# EAGLE schematic Pro Trinket-Micro Keyboard Jr v1 (EAGLE 7.4.0)
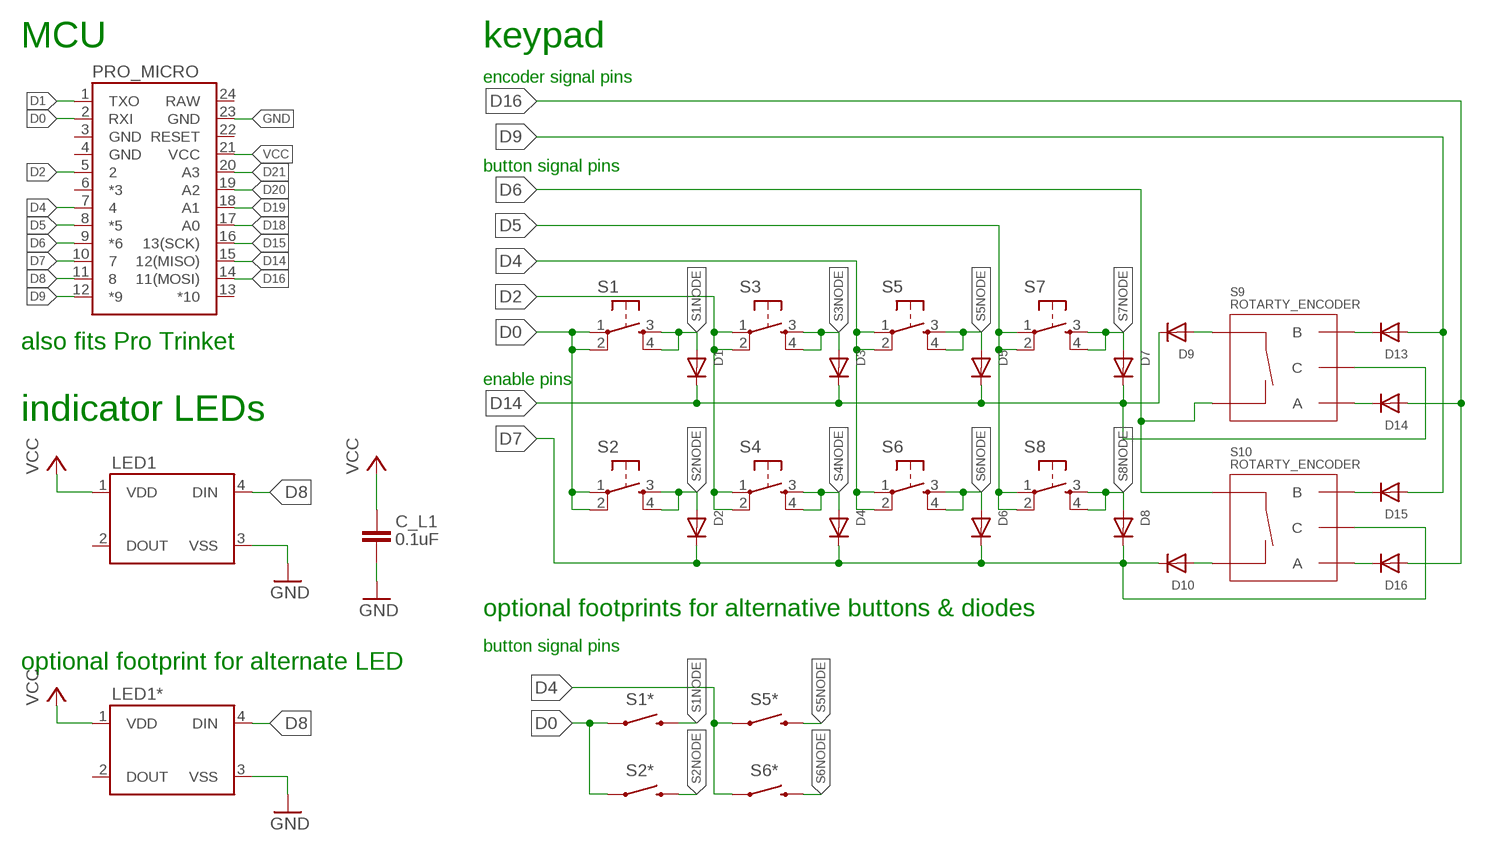
[diagram p0: schematic, sheet 1]

## Parts
C_L1  0.1uF  22PF-50V-5%(0603)  [0603-CAP]
D1  DIODESOD-123  [SOD-123]
D2  DIODESOD-123  [SOD-123]
D3  DIODESOD-123  [SOD-123]
D4  DIODESOD-123  [SOD-123]
D5  DIODESOD-123  [SOD-123]
D6  DIODESOD-123  [SOD-123]
D7  DIODESOD-123  [SOD-123]
D8  DIODESOD-123  [SOD-123]
D9  DIODESOD-123  [SOD-123]
D10  DIODESOD-123  [SOD-123]
D13  DIODESOD-123  [SOD-123]
D14  DIODESOD-123  [SOD-123]
D15  DIODESOD-123  [SOD-123]
D16  DIODESOD-123  [SOD-123]
LED1  WS2812B  [WS2812B]
LED1*  WS2812B  [WS2812B]
PRO_MICRO  ARDUINO_PRO_MICRO  [ARDUINO_PRO_MICRO]
S1  TACTILE-SWITCH-PTH  [TAC-SWITCH-PTH]
S1*  SWITCH-MOMENTARY-212MM  [TACTILE-PTH-12MM]
S2  TACTILE-SWITCH-PTH  [TAC-SWITCH-PTH]
S2*  SWITCH-MOMENTARY-212MM  [TACTILE-PTH-12MM]
S3  TACTILE-SWITCH-PTH  [TAC-SWITCH-PTH]
S4  TACTILE-SWITCH-PTH  [TAC-SWITCH-PTH]
S5  TACTILE-SWITCH-PTH  [TAC-SWITCH-PTH]
S5*  SWITCH-MOMENTARY-212MM  [TACTILE-PTH-12MM]
S6  TACTILE-SWITCH-PTH  [TAC-SWITCH-PTH]
S6*  SWITCH-MOMENTARY-212MM  [TACTILE-PTH-12MM]
S7  TACTILE-SWITCH-PTH  [TAC-SWITCH-PTH]
S8  TACTILE-SWITCH-PTH  [TAC-SWITCH-PTH]
S9  ROTARTY_ENCODER  [ROTARY_ENC_PLAIN]
S10  ROTARTY_ENCODER  [ROTARY_ENC_PLAIN]

## Nets
D0: PRO_MICRO.2(RXI) S1*.1 S1*.2 S1.1 S1.2 S2*.1 S2*.2 S2.1 S2.2
D1: PRO_MICRO.1(TXO)
D2: PRO_MICRO.5 S3.1 S3.2 S4.1 S4.2
D4: PRO_MICRO.7 S5*.1 S5*.2 S5.1 S5.2 S6*.1 S6*.2 S6.1 S6.2
D5: PRO_MICRO.8(*5) S7.1 S7.2 S8.1 S8.2
D6: PRO_MICRO.9(*6) S9.SW- S10.SW+
D7: D2.C D4.C D6.C D8.C D10.C PRO_MICRO.10 S10.C
D8: LED1*.4(DIN) LED1.4(DIN) PRO_MICRO.11
D9: D13.A D15.A PRO_MICRO.12(*9)
D14: D1.C D3.C D5.C D7.C D9.C PRO_MICRO.15(12(MISO)) S9.C
D15: PRO_MICRO.16(13(SCK))
D16: D14.A D16.A PRO_MICRO.14(11(MOSI))
D18: PRO_MICRO.17(A0)
D19: PRO_MICRO.18(A1)
D20: PRO_MICRO.19(A2)
D21: PRO_MICRO.20(A3)
GND: C_L1.1 LED1*.3(VSS) LED1.3(VSS) PRO_MICRO.23(GND)
N$1: D9.A S9.SW+
N$34: D10.A S10.SW-
N$41: D16.C S10.A
N$42: D15.C S10.B
N$43: D14.C S9.A
N$44: D13.C S9.B
S1NODE: D1.A S1*.3 S1*.4 S1.3 S1.4
S2NODE: D2.A S2*.3 S2*.4 S2.3 S2.4
S3NODE: D3.A S3.3 S3.4
S4NODE: D4.A S4.3 S4.4
S5NODE: D5.A S5*.3 S5*.4 S5.3 S5.4
S6NODE: D6.A S6*.3 S6*.4 S6.3 S6.4
S7NODE: D7.A S7.3 S7.4
S8NODE: D8.A S8.3 S8.4
VCC: C_L1.2 LED1*.1(VDD) LED1.1(VDD) PRO_MICRO.21(VCC)
Unconnected: LED1*.2(DOUT) LED1.2(DOUT) PRO_MICRO.3(GND) PRO_MICRO.4(GND) PRO_MICRO.6(*3) PRO_MICRO.13(*10) PRO_MICRO.22(RESET) PRO_MICRO.24(RAW)

## Notes on the sheet
- MCU | keypad
- encoder signal pins
- button signal pins
- also fits Pro Trinket
- enable pins
- indicator LEDs
- optional footprints for alternative buttons & diodes
- button signal pins
- optional footprint for alternate LED

## Library data of the parts
C_L1 = SparkFun-Capacitors:22PF-50V-5%(0603): CAP-07876; PROD_ID: CAP-07876; VALUE: 22pF
D1-D10 D13-D16 = adafruit:DIODE: Diode SMADIODE - SMA Surface Mount Package 20V 1A Schottky Diode Digikey: 641-1014-6-ND DO-1N4148 - Through Hole Small Current Diode SOD-123 20V 1 A (.5mV Vf) Schottky Diode - Digikey: MBRX120TPMSCT-ND SOD-323 10V 570mA (.38mV Vf, 3ns) Schottky Diode - Digikey: ZLLS410CT-ND SOD-523 30V 30mA Schottky Diode (RB751S-40TE61) - Digikey: RB751S-40TE61CT-ND SOT23-R/W - SOT23 Package (R = Solder Paste/Reflow Ovens, W = Hand-Soldering) BAT54Film 40V 300mA - Digikey: 497-7162-1-ND
LED1 LED1* = SparkFun-LED:WS2812B: WS2812B - Intelligent control LED integrated light source Technical Specifications: Power Supply Voltage (VDD): 3.5 to 5.3 V Input Voltage (VI): -0.5 to VDD+0.5 V Operating Junction Temperature (Topt): -25°C to +80°C Storage Temperature Range (Tstg): -55°C to +150°C
PRO_MICRO = SparkFun-Boards:ARDUINO_PRO_MICRO
S1-S8 = GeekAmmo:TACTILE-SWITCH: Tactile Switch 4 Pins, SPST NO
S1* S2* S5* S6* = SparkFun-Electromechanical:SWITCH-MOMENTARY-2: Various NO switches- pushbuttons, reed, etc; PROD_ID: SWCH-09185
S9 S10 = SparkFun-Electromechanical:ROTARTY_ENCODER: Simple no LED rotary encoder Example: COM-09117